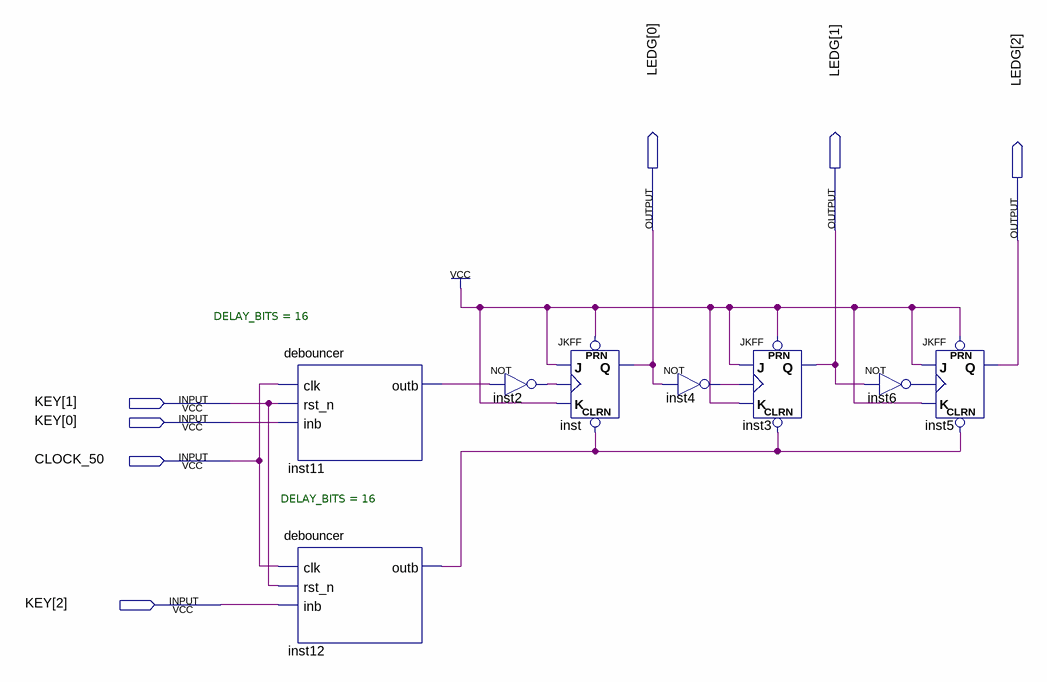
[diagram p0: schematic sheet]
// Quartus schematic async_counter.bdf as structural Verilog: 8 symbols, 7 pins
module async_counter (
  input  [2:0] KEY,
  input  CLOCK_50,
  output [2:0] LEDG
);

  wire inst2_out, inst4_out, inst6_out, inst11_outb, inst12_outb;

  debouncer #(.DELAY_BITS(16)) inst11 (.clk(CLOCK_50), .rst_n(KEY[1]), .inb(KEY[0]), .outb(inst11_outb));
  debouncer #(.DELAY_BITS(16)) inst12 (.clk(CLOCK_50), .rst_n(KEY[1]), .inb(KEY[2]), .outb(inst12_outb));
  not inst2 (inst2_out, inst11_outb);
  JKFF inst (.PRN(1'b1), .CLRN(inst12_outb), .K(1'b1), .J(1'b1), .CLK(inst2_out), .Q(LEDG[0]));
  not inst4 (inst4_out, LEDG[0]);
  JKFF inst3 (.PRN(1'b1), .CLRN(inst12_outb), .K(1'b1), .J(1'b1), .CLK(inst4_out), .Q(LEDG[1]));
  JKFF inst5 (.PRN(1'b1), .CLRN(inst12_outb), .K(1'b1), .J(1'b1), .CLK(inst6_out), .Q(LEDG[2]));
  not inst6 (inst6_out, LEDG[1]);
endmodule
